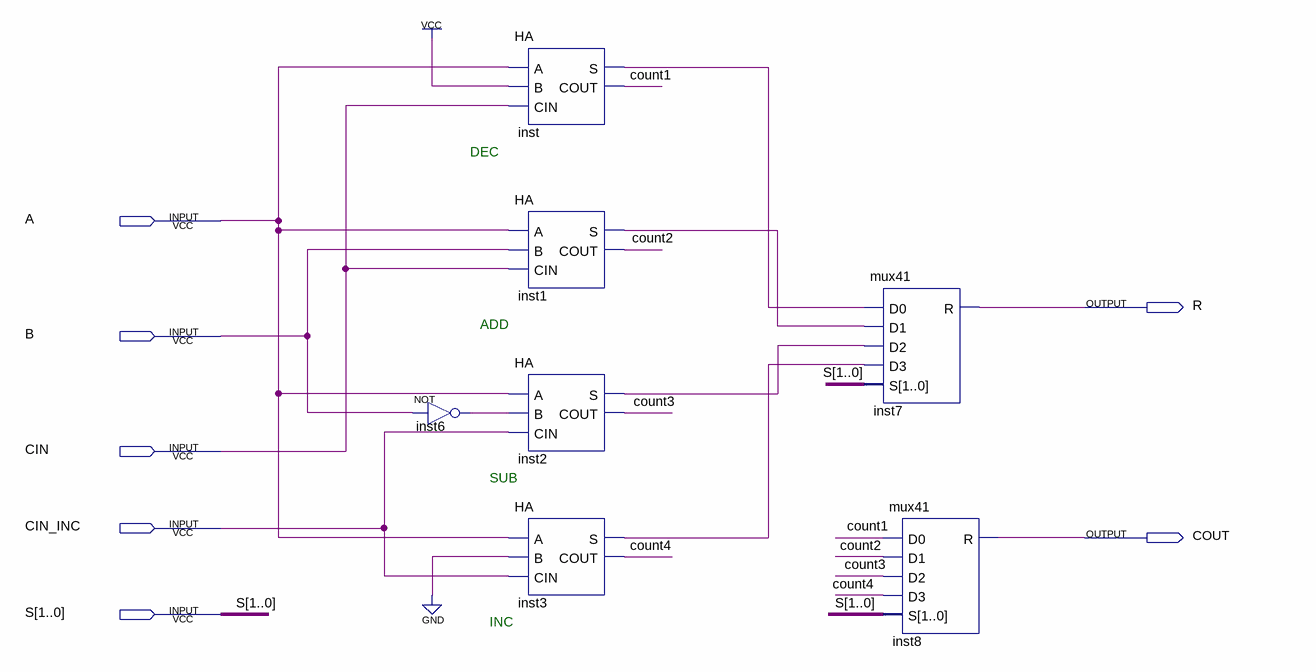
[diagram p0: schematic sheet]
// Quartus schematic AU.bdf as structural Verilog: 7 symbols, 7 pins
module AU (
  input  A,
  input  B,
  input  CIN,
  input  CIN_INC,
  input  [1:0] S,
  output R,
  output COUT
);

  wire count1, count2, count3, count4, inst1_s, inst2_s, inst3_s, inst6_out, inst_s;

  not inst6 (inst6_out, B);
  HA inst (.A(A), .B(1'b1), .CIN(CIN), .S(inst_s), .COUT(count1));
  HA inst1 (.A(A), .B(B), .CIN(CIN), .S(inst1_s), .COUT(count2));
  HA inst2 (.A(A), .B(inst6_out), .CIN(CIN_INC), .S(inst2_s), .COUT(count3));
  HA inst3 (.A(A), .B(1'b0), .CIN(CIN_INC), .S(inst3_s), .COUT(count4));
  mux41 inst7 (.D0(inst_s), .D1(inst1_s), .D2(inst2_s), .D3(inst3_s), .S(S), .R(R));
  mux41 inst8 (.D0(count1), .D1(count2), .D2(count3), .D3(count4), .S(S), .R(COUT));

  // Notes on the sheet:
  //   DEC
  //   ADD
  //   SUB
  //   INC
endmodule
